# EAGLE schematic PCB-ARD-MXBOS (EAGLE 6.4)
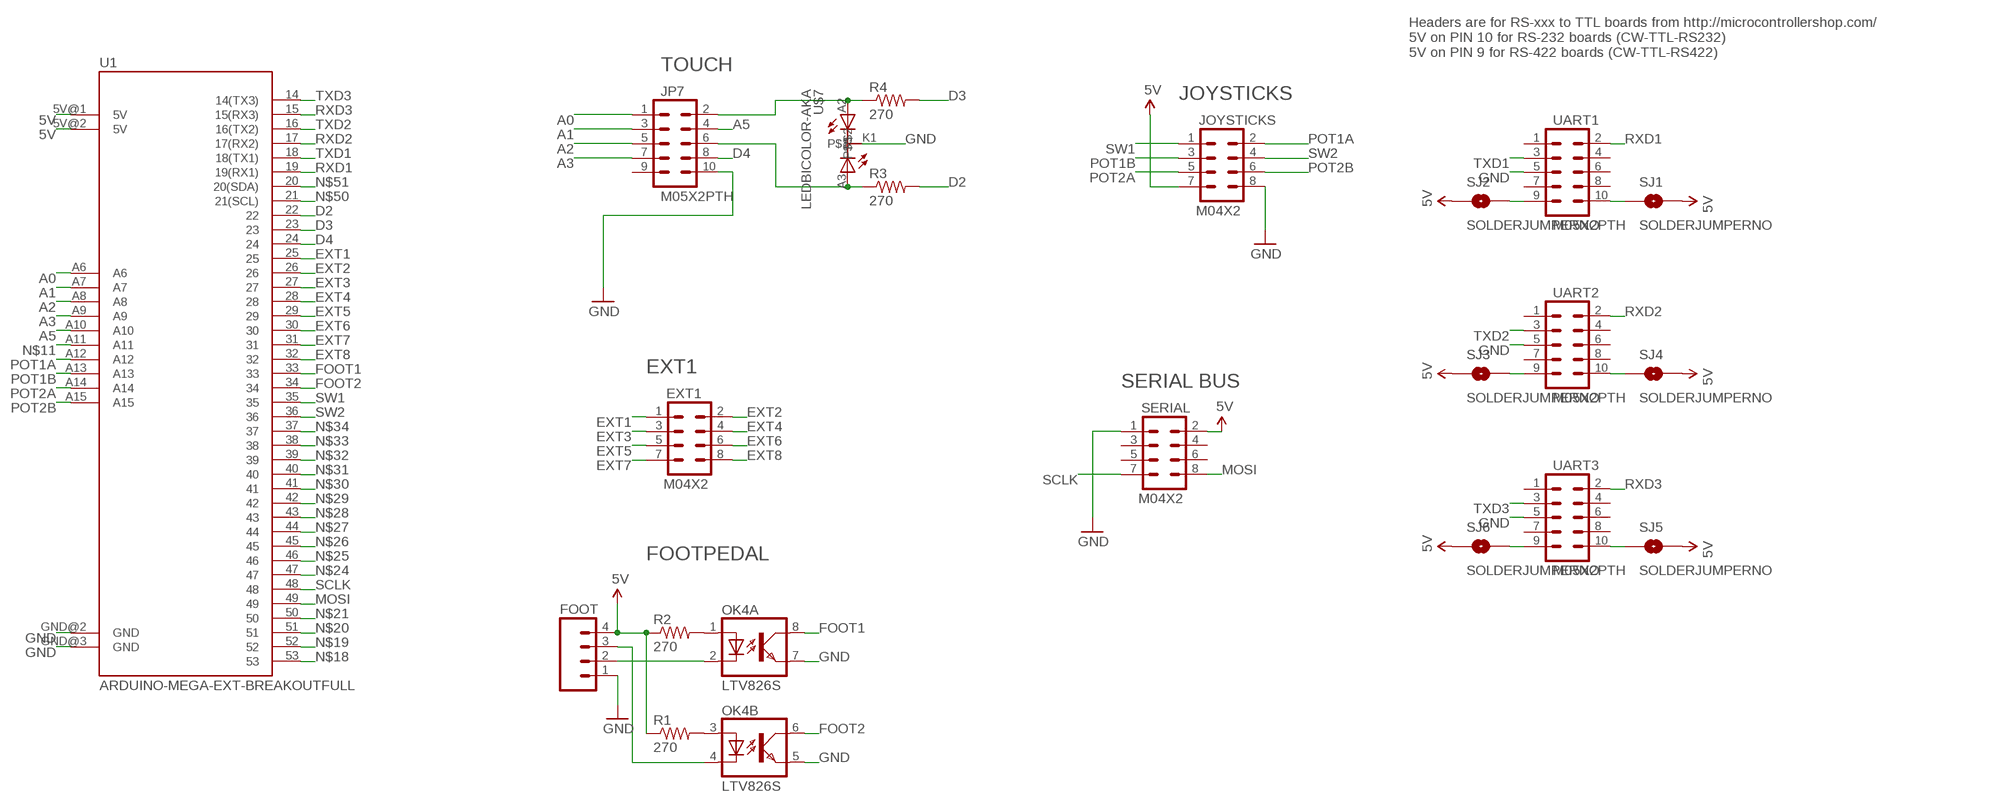
[diagram p0: schematic, sheet 1]

## Parts
EXT1  M04X2  [2X4]
FOOT  M04LOCK  [1X04_LOCK]
JOYSTICKS  M04X2  [2X4]
JP7  M05X2PTH  [AVR_ICSP]
OK4  LTV826S  [DIL8-SMD]
R1  270  RESISTOR0603-RES  [0603-RES]
R2  270  RESISTOR0603-RES  [0603-RES]
R3  270  RESISTOR0603-RES  [0603-RES]
R4  270  RESISTOR0603-RES  [0603-RES]
SERIAL  M04X2  [2X4]
SJ1  SOLDERJUMPERNO  [SJ_2S-NO]
SJ2  SOLDERJUMPERNO  [SJ_2S-NO]
SJ3  SOLDERJUMPERNO  [SJ_2S-NO]
SJ4  SOLDERJUMPERNO  [SJ_2S-NO]
SJ5  SOLDERJUMPERNO  [SJ_2S-NO]
SJ6  SOLDERJUMPERNO  [SJ_2S-NO]
U1  ARDUINO-MEGA-EXT-BREAKOUTFULL  [ARDUINO_MEGA_EXT_BREAKOUT]
U$7  LEDBICOLOR-AKA  [LED5MM-BICOLOR]
UART1  M05X2PTH  [AVR_ICSP]
UART2  M05X2PTH  [AVR_ICSP]
UART3  M05X2PTH  [AVR_ICSP]

## Nets
5V [Power]: FOOT.4 JOYSTICKS.7 R1.1 R2.1 SERIAL.2 SJ1.2 SJ2.1 SJ3.1 SJ4.2 SJ5.2 SJ6.1 U1.5V@1(5V) U1.5V@2(5V)
A0: JP7.1 U1.A6
A1: JP7.3 U1.A7
A2: JP7.5 U1.A8
A3: JP7.7 U1.A9
A5: JP7.4 U1.A10
D2: R3.2 U1.22
D3: R4.2 U1.23
D4: JP7.8 U1.24
EXT1: EXT1.1 U1.25
EXT2: EXT1.2 U1.26
EXT3: EXT1.3 U1.27
EXT4: EXT1.4 U1.28
EXT5: EXT1.5 U1.29
EXT6: EXT1.6 U1.30
EXT7: EXT1.7 U1.31
EXT8: EXT1.8 U1.32
FOOT1: OK4.8(A:COL) U1.33
FOOT2: OK4.6(B:COL) U1.34
GND [Power]: FOOT.1 JOYSTICKS.8 JP7.10 OK4.5(B:EMIT) OK4.7(A:EMIT) SERIAL.1 U1.GND@2(GND) U1.GND@3(GND) U$7.K1 UART1.5 UART2.5 UART3.5
MOSI: SERIAL.8 U1.49
N$1: OK4.3(B:A) R1.2
N$2: OK4.1(A:A) R2.2
N$3: SJ6.2 UART3.9
N$4: FOOT.2 OK4.2(A:C)
N$5: FOOT.3 OK4.4(B:C)
N$6: SJ3.2 UART2.9
N$7: JP7.2 R4.1 U$7.A2
N$8: JP7.6 R3.1 U$7.A3
N$9: SJ2.2 UART1.9
N$10: SJ1.1 UART1.10
N$11: U1.A11
N$12: SJ4.1 UART2.10
N$13: SJ5.1 UART3.10
N$18: U1.53
N$19: U1.52
N$20: U1.51
N$21: U1.50
N$24: U1.47
N$25: U1.46
N$26: U1.45
N$27: U1.44
N$28: U1.43
N$29: U1.42
N$30: U1.41
N$31: U1.40
N$32: U1.39
N$33: U1.38
N$34: U1.37
N$50: U1.21(21(SCL))
N$51: U1.20(20(SDA))
POT1A: JOYSTICKS.2 U1.A12
POT1B: JOYSTICKS.3 U1.A13
POT2A: JOYSTICKS.5 U1.A14
POT2B: JOYSTICKS.6 U1.A15
RXD1: U1.19(19(RX1)) UART1.2
RXD2: U1.17(17(RX2)) UART2.2
RXD3: U1.15(15(RX3)) UART3.2
SCLK: SERIAL.7 U1.48
SW1: JOYSTICKS.1 U1.35
SW2: JOYSTICKS.4 U1.36
TXD1: U1.18(18(TX1)) UART1.3
TXD2: U1.16(16(TX2)) UART2.3
TXD3: U1.14(14(TX3)) UART3.3
Unconnected: JP7.9 SERIAL.3 SERIAL.4 SERIAL.5 SERIAL.6 UART1.1 UART1.4 UART1.6 UART1.7 UART1.8 UART2.1 UART2.4 UART2.6 UART2.7 UART2.8 UART3.1 UART3.4 UART3.6 UART3.7 UART3.8

## Notes on the sheet
- Headers are for RS-xxx to TTL boards from http://microcontrollershop.com/
  5V on PIN 10 for RS-232 boards (CW-TTL-RS232)
  5V on PIN 9 for RS-422 boards (CW-TTL-RS422)
- TOUCH
- JOYSTICKS
- EXT1
- SERIAL BUS
- FOOTPEDAL

## Library data of the parts
EXT1 JOYSTICKS SERIAL = SparkFun:M04X2
FOOT = SparkFun:M04: Header 4 Standard 4-pin 0.1" header. Use with straight break away headers (SKU : PRT-00116), right angle break away headers (PRT-00553), swiss pins (PRT-00743), machine pins (PRT-00117), and female headers (PRT-00115). Molex polarized connector foot print use with SKU : PRT-08231 with associated crimp pins and housings. 1MM SMD Version SKU: PRT-10208
JP7 UART1-UART3 = SparkFun:M05X2: Header 5x2 Standard 10-pin dual row 0.1" header. Commonly used with AVR-ISP. Use with Spark Fun Electronics SKU: PRT-00778
OK4 = optocoupler:LTV826: OPTO COUPLER Source: LITEON, LTV816.pdf; OC_FARNELL: unknown; OC_NEWARK: unknown
R1-R4 = SparkFun:RESISTOR: Resistor Basic schematic elements and footprints for 0603, 1206, and PTH resistors.
SJ1-SJ6 = SparkFun:SOLDERJUMPER: Solder Jumper Standard SMD solder jumper. Used to automate production. Two varients : Normally Open and Normally Closed are the same, but have different paste layers. NC will have a large amount of paste and should jumper during reflow.
U1 = SKAARHOJ:ARDUINO-MEGA-EXT-BREAKOUT: Arduino Mega footprint connections
U$7 = SKAARHOJ:LEDBICOLOR-AKA

## Net classes
0 default: width 0.152 mm, drill 0.406 mm, clearance 0.152 mm
1 Power: width 0.406 mm, drill 0.61 mm, clearance 0.254 mm
3 INput lines: clearance 0.203 mm